# Altium schematic sheet 04_Storage&Sensor.SchDoc
size A4
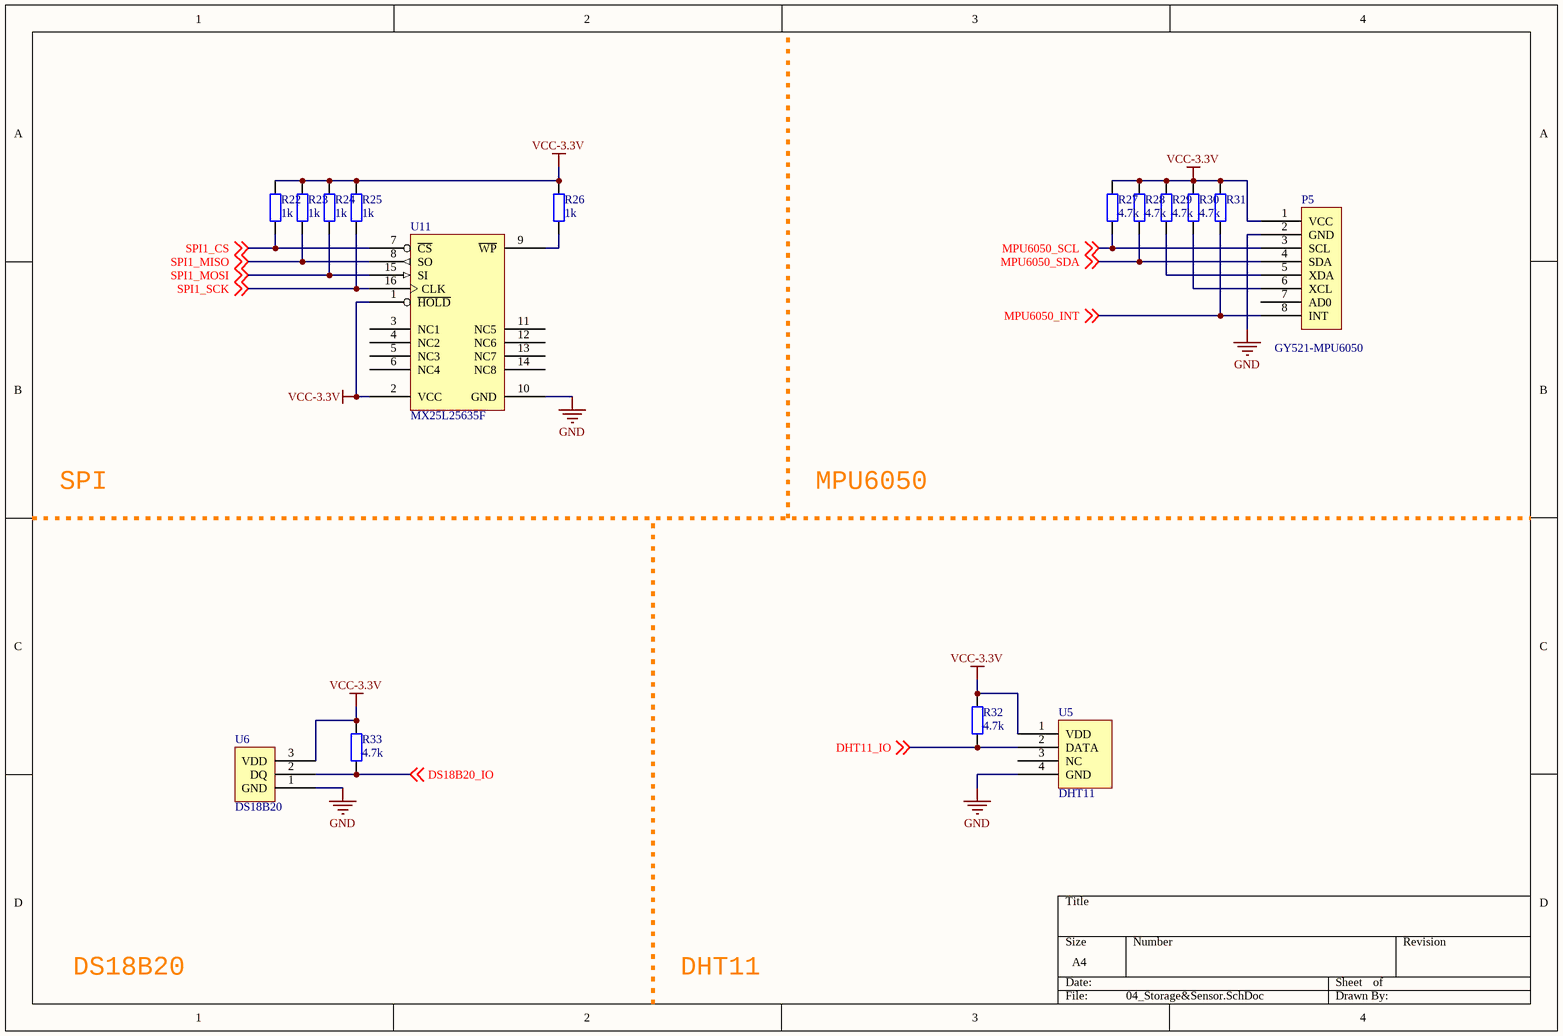
[diagram p0: 04_Storage&Sensor.SchDoc]

## Parts
P5  GY521-MPU6050  [GY521-MPU6050]
R22  value 1k  [AXIAL-0.3]  (hidden comment: 10k)
R23  value 1k  [AXIAL-0.3]  (hidden comment: 10k)
R24  value 1k  [AXIAL-0.3]  (hidden comment: 10k)
R25  value 1k  [AXIAL-0.3]  (hidden comment: 10k)
R26  value 1k  [AXIAL-0.3]  (hidden comment: 10k)
R27  value 4.7k  [AXIAL-0.3]  (hidden comment: 10k)
R28  value 4.7k  [AXIAL-0.3]  (hidden comment: 10k)
R29  value 4.7k  [AXIAL-0.3]  (hidden comment: 10k)
R30  value 4.7k  [AXIAL-0.3]  (hidden comment: 10k)
R31  10k  [AXIAL-0.3]  (value not drawn)
R32  value 4.7k  [AXIAL-0.3]  (hidden comment: 10k)
R33  value 4.7k  [AXIAL-0.3]  (hidden comment: 10k)
U5  DHT11  [DHT-11]
U6  DS18B20  [TO-92]
U11  MX25L25635F  [SOL-16_M]

## Nets
GND: P5.2(GND) U5.4(GND) U6.1(GND) U11.10(GND)
VCC-3.3V: P5.1(VCC) R22.1 R23.2 R24.2 R25.2 R26.2 R27.1 R28.1 R29.1 R30.1 R31.1 R32.1 R33.1 U5.1(VDD) U6.3(VDD) U11.1(~{HOLD}) U11.2(VCC)
DHT11_IO: R32.2 U5.2(DATA) ; off-sheet DHT11_IO
DS18B20_IO: R33.2 U6.2(DQ) ; off-sheet DS18B20_IO
MPU6050_INT: P5.8(INT) R31.2 ; off-sheet MPU6050_INT
MPU6050_SCL: P5.3(SCL) R27.2 ; off-sheet MPU6050_SCL
MPU6050_SDA: P5.4(SDA) R28.2 ; off-sheet MPU6050_SDA
SPI1_CS: R22.2 U11.7(~{CS}) ; off-sheet SPI1_CS
SPI1_MISO: R23.1 U11.8(SO) ; off-sheet SPI1_MISO
SPI1_MOSI: R24.1 U11.15(SI) ; off-sheet SPI1_MOSI
SPI1_SCK: R25.1 U11.16(CLK) ; off-sheet SPI1_SCK
NetP5_5: P5.5(XDA) R29.2
NetP5_6: P5.6(XCL) R30.2
NetR26_1: R26.1 U11.9(~{WP})

Not connected (* = marked no-connect by the designer): P5 7(AD0); U5 3(NC); U11 3(NC1) 4(NC2) 5(NC3) 6(NC4) 11(NC5) 12(NC6) 13(NC7) 14(NC8)

## Notes on the sheet
- SPI Flash
- MPU6050
- DS18B20
- DHT11

## Library data of the parts
P5 = GY521-MPU6050: INVENSENSE   MPU-6050   MEMS Module, Tri-Axis Gyroscope, Tri-Axis Accelerometer, 2.5 V, 3.6 V, QFN, 24 Pins; Unit PriceUSD: Digital; Dynamic Catalog: MPU-6000™ Series; Featured Product: MPU-6050 6-Axis, Integrated I²C Solution; Sensor Type: Motion Tracking; Other Names: 1428-1007-2 / MPU6050; Supplier 1: Digikey; Manufacturer: Invensense; Manufacturer Part Number: MPU-6050; Stock 1: 10000; Pricing 1: 5000=3.4979 (USD); Standard Package: 5,000; Category: Sensors, Transducers; Family: Multifunction; Output Type: Digital; Online Catalog: MPU-6000™ Series; ComponentLink1URL: https://datasheet.ciiva.com/1513/1788002-1513632.pdf; ComponentLink1Description: https://datasheet.ciiva.com/1513/1788002-1513632.pdf; ComponentLink2URL: https://datasheet.ciiva.com/22731/1788002-22731434.pdf; ComponentLink2Description: https://datasheet.ciiva.com/22731/1788002-22731434.pdf
R22-R30 R32 R33 = Res1: 贴片电阻; Published: 8-Jun-2000; LatestRevisionDate: 17-Jul-2002; LatestRevisionNote: Re-released for DXP Platform.; PackageReference: AXIAL-0.4; Publisher: Altium Limited
R31 = Res1: 贴片电阻; Value: 4.7k; Published: 8-Jun-2000; LatestRevisionDate: 17-Jul-2002; LatestRevisionNote: Re-released for DXP Platform.; PackageReference: AXIAL-0.4; Publisher: Altium Limited
U5 = DHT11: Manufacturer: Sensirion; Manufacturer Part Number: SHT11; Humidity Sensor Type: Capacitive; Humidity Range: 0% to 100% Relative Humidity; Supply Voltage: 3.3V; Sensor Case Style: LCC; No. of Pins: 8; Response Time: 8s; SVHC: No SVHC (20-Jun-2013); Leaded Process Compatible: Yes; Sensitivity: ± 1%; Humidity Accuracy ±: 3%; Supplier 1: Digikey; Stock 1: 500; Pricing 1: 100=13.671, 300=13.23, 500=12.789 (USD); Package / Case: 4-LCC SMD; Peak Reflow Compatible (260 C): Yes; RoHS Compliant: Yes; Humidity Accuracy ?: 3%; Sensing Accuracy: 3%; Packaging: Cut Tape; Accuracy %: 3%; Operating Temperature Max: 125°C; Operating Temperature Min: -40°C; ComponentLink1URL: https://datasheet.ciiva.com/1293/sensirion-humidity-sht1x-datasheet-v5-1293456.pdf; ComponentLink1Description: https://datasheet.ciiva.com/1293/sensirion-humidity-sht1x-datasheet-v5-1293456.pdf; ComponentLink2URL: https://datasheet.ciiva.com/23951/317085-23951520.pdf; ComponentLink2Description: https://datasheet.ciiva.com/23951/317085-23951520.pdf; ComponentLink3URL: https://datasheet.ciiva.com/22712/1563786-22712371.pdf; ComponentLink3Description: https://datasheet.ciiva.com/22712/1563786-22712371.pdf
U6 = DS18B20: MAXIM INTEGRATED PRODUCTS         DS18B20+.             12bit,  0.5C 1 Wire Digital Thermometer with Programmable Resolution in TO-92-3 Package; SVHC: To Be Advised; Sensing Accuracy Range: ± 0.5°C; Sensing Temperature Min: -55°C; Sensing Temperature Max: +125°C; Supply Voltage Min: 3V; Supply Voltage Max: 5.5V; No. of Pins: 3; Supply Current: 1mA; Base Number: 18; IC Generic Number: 18B20; Output Current: 4mA; Sensor / Transducer Type: Temperature; Supply Voltage Range: 3V to 5.5V; Temperature Sensing Range: -55°C to +125°C; Supplier 1: Digikey; Manufacturer: Maxim; Manufacturer Part Number: DS18B20+; Stock 1: 9817; Pricing 1: 1=2.78, 10=2.678 (USD); IC Output Type: Digital; Sensor Case Style: TO-92; Resolution (Bits): 12bit; MSL: (Not Available); Device Marking: DS18B20+; Logic Function Number: 18B20; Operating Temperature Max: 125°C; Operating Temperature Min: -55°C; Operating Temperature Range: -55°C to +125°C; Package / Case: TO-92; Resolution: 12bit; ComponentLink1URL: https://datasheet.ciiva.com/14100/ds18b20-eng-tds-14100018.pdf; ComponentLink1Description: https://datasheet.ciiva.com/14100/ds18b20-eng-tds-14100018.pdf; ComponentLink2URL: https://datasheet.ciiva.com/46354/136-ds18b20-46354613.pdf; ComponentLink2Description: https://datasheet.ciiva.com/46354/136-ds18b20-46354613.pdf; ComponentLink3URL: https://datasheet.ciiva.com/23809/46379-23809287.pdf; ComponentLink3Description: https://datasheet.ciiva.com/23809/46379-23809287.pdf; ComponentLink4URL: https://datasheet.ciiva.com/16470/ds18b20-16470492.pdf; ComponentLink4Description: https://datasheet.ciiva.com/16470/ds18b20-16470492.pdf; ComponentLink5URL: https://datasheet.ciiva.com/19456/865936-19456316.pdf; ComponentLink5Description: https://datasheet.ciiva.com/19456/865936-19456316.pdf; ComponentLink6URL: https://datasheet.ciiva.com/2003/ds18b20-2003437.pdf; ComponentLink6Description: https://datasheet.ciiva.com/2003/ds18b20-2003437.pdf; ComponentLink7URL: https://datasheet.ciiva.com/3277/ds18b20-3277869.pdf; ComponentLink7Description: https://datasheet.ciiva.com/3277/ds18b20-3277869.pdf; ComponentLink8URL: https://datasheet.ciiva.com/5696/ds18s20-5696782.pdf; ComponentLink8Description: https://datasheet.ciiva.com/5696/ds18s20-5696782.pdf; ComponentLink9URL: https://datasheet.ciiva.com/26887/ds18b20-26887123.pdf; ComponentLink9Description: https://datasheet.ciiva.com/26887/ds18b20-26887123.pdf
U11 = MX25L25635F: IC FLASH 256MBIT 104MHZ 16SOP; Manufacturer: Macronix; Manufacturer Part Number: MX25L25635FMI-10G; Supply Voltage-Nom: 2.7 to 3.6 V; Memory Organization: 256 M x 1 / 128 M ...; Memory Density: 256 Mb; Supplier 1: Digikey; Stock 1: 4642; Pricing 1: 1=3.84 (USD); Temperature Grade: Industrial; Clock Frequency-Max: 104 MHz; ComponentLink1URL: http://media.digikey.com/pdf/Data%20Sheets/Macronix/MX25L25635F.pdf; ComponentLink1Description: http://media.digikey.com/pdf/Data%20Sheets/Macronix/MX25L25635F.pdf